# EAGLE design flasher (EAGLE 7.5.0)
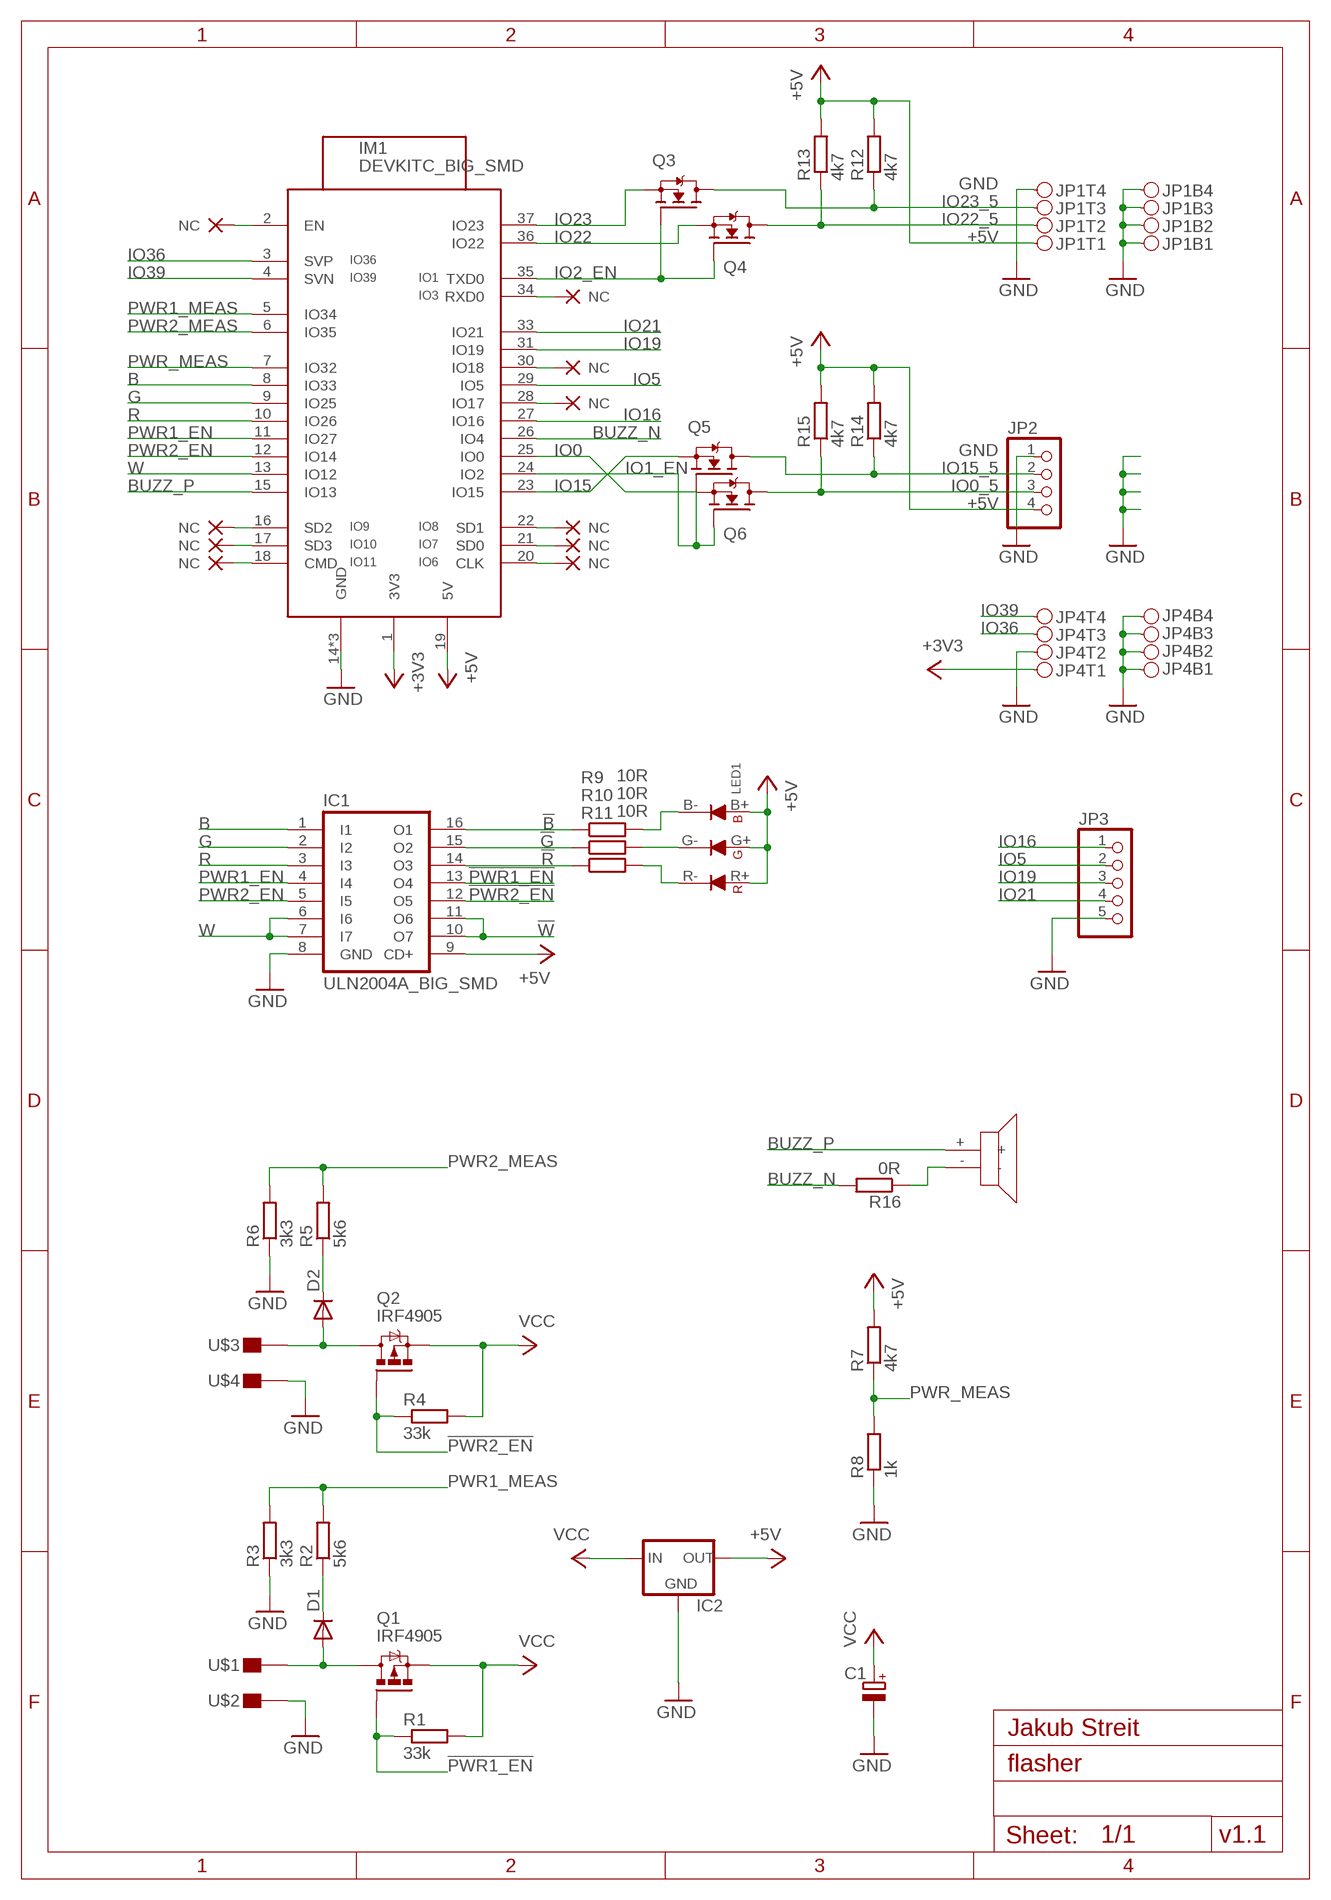
[diagram p0: schematic, sheet 1]

## Parts
C1  CPOL-EUE5-10.5  [E5-10,5]
D1  DIODE-SOD123  [SOD123]
D2  DIODE-SOD123  [SOD123]
IC1  ULN2004A_BIG_SMD  [DIL16_BIG_SMD]
IC2  78XXS  [78XXS]
IM1  DEVKITC_BIG_SMD  [DEVKITC_BIG_SMD]
JP1  PINH2X04  [PINH2X04SMD]
JP2  PINHD-1X4/90  [1X04/90]
JP3  PINHD-1X5  [1X05]
JP4  PINH2X04  [PINH2X04SMD]
LED1  RGB_LED  [HEX_HEATSINK]
NC1  NC  (no package)
NC2  NC  (no package)
NC3  NC  (no package)
NC4  NC  (no package)
NC5  NC  (no package)
NC6  NC  (no package)
NC7  NC  (no package)
NC8  NC  (no package)
NC9  NC  (no package)
NC10  NC  (no package)
Q1  IRF4905  IRF9530  [TO220BV]
Q2  IRF4905  IRF9530  [TO220BV]
Q3  N-MOSFET-SOT23-DIST  [SOT23_DIST]
Q4  N-MOSFET-SOT23-DIST  [SOT23_DIST]
Q5  N-MOSFET-SOT23-DIST  [SOT23_DIST]
Q6  N-MOSFET-SOT23-DIST  [SOT23_DIST]
R1  33k  R-EU_R0805S  [R0805S]
R2  5k6  R-EU_R0805S  [R0805S]
R3  3k3  R-EU_R0805S  [R0805S]
R4  33k  R-EU_R0805S  [R0805S]
R5  5k6  R-EU_R0805S  [R0805S]
R6  3k3  R-EU_R0805S  [R0805S]
R7  4k7  R-EU_R0805S  [R0805S]
R8  1k  R-EU_R0805S  [R0805S]
R9  10R  R-EU_R2512  [R2512]
R10  10R  R-EU_R2512  [R2512]
R11  10R  R-EU_R2512  [R2512]
R12  4k7  R-EU_R0805S  [R0805S]
R13  4k7  R-EU_R0805S  [R0805S]
R14  4k7  R-EU_R0805S  [R0805S]
R15  4k7  R-EU_R0805S  [R0805S]
R16  0R  R-EU_R0805S  [R0805S]
U$1  PAD_1SIDE_LARGE  [3X5MM]
U$2  PAD_1SIDE_LARGE  [3X5MM]
U$3  PAD_1SIDE_LARGE  [3X5MM]
U$4  PAD_1SIDE_LARGE  [3X5MM]
U$5  PIEZO  [PIEZO]

## Nets
!B: IC1.16(O1) R9.1
!G: IC1.15(O2) R10.1
!PWR1_EN: IC1.13(O4) Q1.G R1.1
!PWR2_EN: IC1.12(O5) Q2.G R4.1
!R: IC1.14(O3) R11.1
!W: IC1.10(O7) IC1.11(O6)
+3V3: IM1.1(3V3) JP4.T1
+5V: IC1.9(CD+) IC2.OUT IM1.19(5V) JP1.T1 JP2.4 LED1.B+(BA) LED1.G+(GA) LED1.R+(RA) R7.2 R12.2 R13.2 R14.2 R15.2
B: IC1.1(I1) IM1.8(IO33)
BA: LED1.B-(BC) R9.2
BUZZ-N: R16.1 U$5.-
BUZZ_N: IM1.26(IO4) R16.2
BUZZ_P: IM1.15(IO13) U$5.+
EN: IM1.2(EN) NC7.NC
G: IC1.2(I2) IM1.9(IO25)
GA: LED1.G-(GC) R10.2
GND: C1.- IC1.8(GND) IC2.GND IM1.14(GND) IM1.32(GND) IM1.38(GND) JP1.B1 JP1.B2 JP1.B3 JP1.B4 JP1.T4 JP2.1 JP3.5 JP4.B1 JP4.B2 JP4.B3 JP4.B4 JP4.T2 R3.1 R6.1 R8.1 U$2.1 U$4.1
IO0: IM1.25(IO0) Q6.2(S)
IO0_5: JP2.3 Q6.3(D) R15.1
IO1_EN: IM1.24(IO2) Q5.1(G) Q6.1(G)
IO2_EN: IM1.35(TXD0) Q3.1(G) Q4.1(G)
IO3: IM1.34(RXD0) NC10.NC
IO5: IM1.29(IO5) JP3.2
IO6: IM1.20(CLK) NC4.NC
IO7: IM1.21(SD0) NC5.NC
IO8: IM1.22(SD1) NC6.NC
IO9: IM1.16(SD2) NC1.NC
IO10: IM1.17(SD3) NC2.NC
IO11: IM1.18(CMD) NC3.NC
IO15: IM1.23(IO15) Q5.2(S)
IO15_5: JP2.2 Q5.3(D) R14.1
IO16: IM1.27(IO16) JP3.1
IO17: IM1.28(IO17) NC9.NC
IO18: IM1.30(IO18) NC8.NC
IO19: IM1.31(IO19) JP3.3
IO21: IM1.33(IO21) JP3.4
IO22: IM1.36(IO22) Q4.2(S)
IO22_5: JP1.T2 Q4.3(D) R13.1
IO23: IM1.37(IO23) Q3.2(S)
IO23_5: JP1.T3 Q3.3(D) R12.1
IO36: IM1.3(SVP) JP4.T3
IO39: IM1.4(SVN) JP4.T4
PWR1: D1.A Q1.D U$1.1
PWR1+: D1.C R2.1
PWR1_EN: IC1.4(I4) IM1.11(IO27)
PWR1_MEAS: IM1.5(IO34) R2.2 R3.2
PWR2: D2.A Q2.D U$3.1
PWR2+: D2.C R5.1
PWR2_EN: IC1.5(I5) IM1.12(IO14)
PWR2_MEAS: IM1.6(IO35) R5.2 R6.2
PWR_MEAS: IM1.7(IO32) R7.1 R8.2
R: IC1.3(I3) IM1.10(IO26)
RA: LED1.R-(RC) R11.2
VCC: C1.+ IC2.IN Q1.S Q2.S R1.2 R4.2
W: IC1.6(I6) IC1.7(I7) IM1.13(IO12)

## Notes on the sheet
- Jakub Streit
- v1.1

## Library data of the parts
C1 = rcl_upravena:CPOL-EU: POLARIZED CAPACITOR, European symbol
D1 D2 = diode:DIODE: DIODE ultra fast-recovery rectifier
IC1 = uln-udn_upravena:ULN2004A: DRIVER ARRAY
IC2 = v-reg:78XXS: VOLTAGE REGULATOR
IM1 = esp32:DEVKITC
JP1 JP4 = pinhead_smd:PINH2X04
JP2 = pinhead:PINHD-1X4: PIN HEADER
JP3 = pinhead:PINHD-1X5: PIN HEADER
LED1 = RGB_LED:RGB_LED
NC1-NC10 = NC:NC: _EXTERNAL_
Q1 Q2 = transistor-power:IRF9530: P-CHANNEL HEXFET POWER-MOS-FET Source: http://www.irf.com/product-info/datasheets/data/irf9530.pdf
Q3-Q6 = transistors:N-MOSFET
R1-R16 = rcl_upravena:R-EU_: RESISTOR, European symbol
U$1-U$4 = wirepad_smd:PAD
U$5 = piezo:PIEZO

## Board
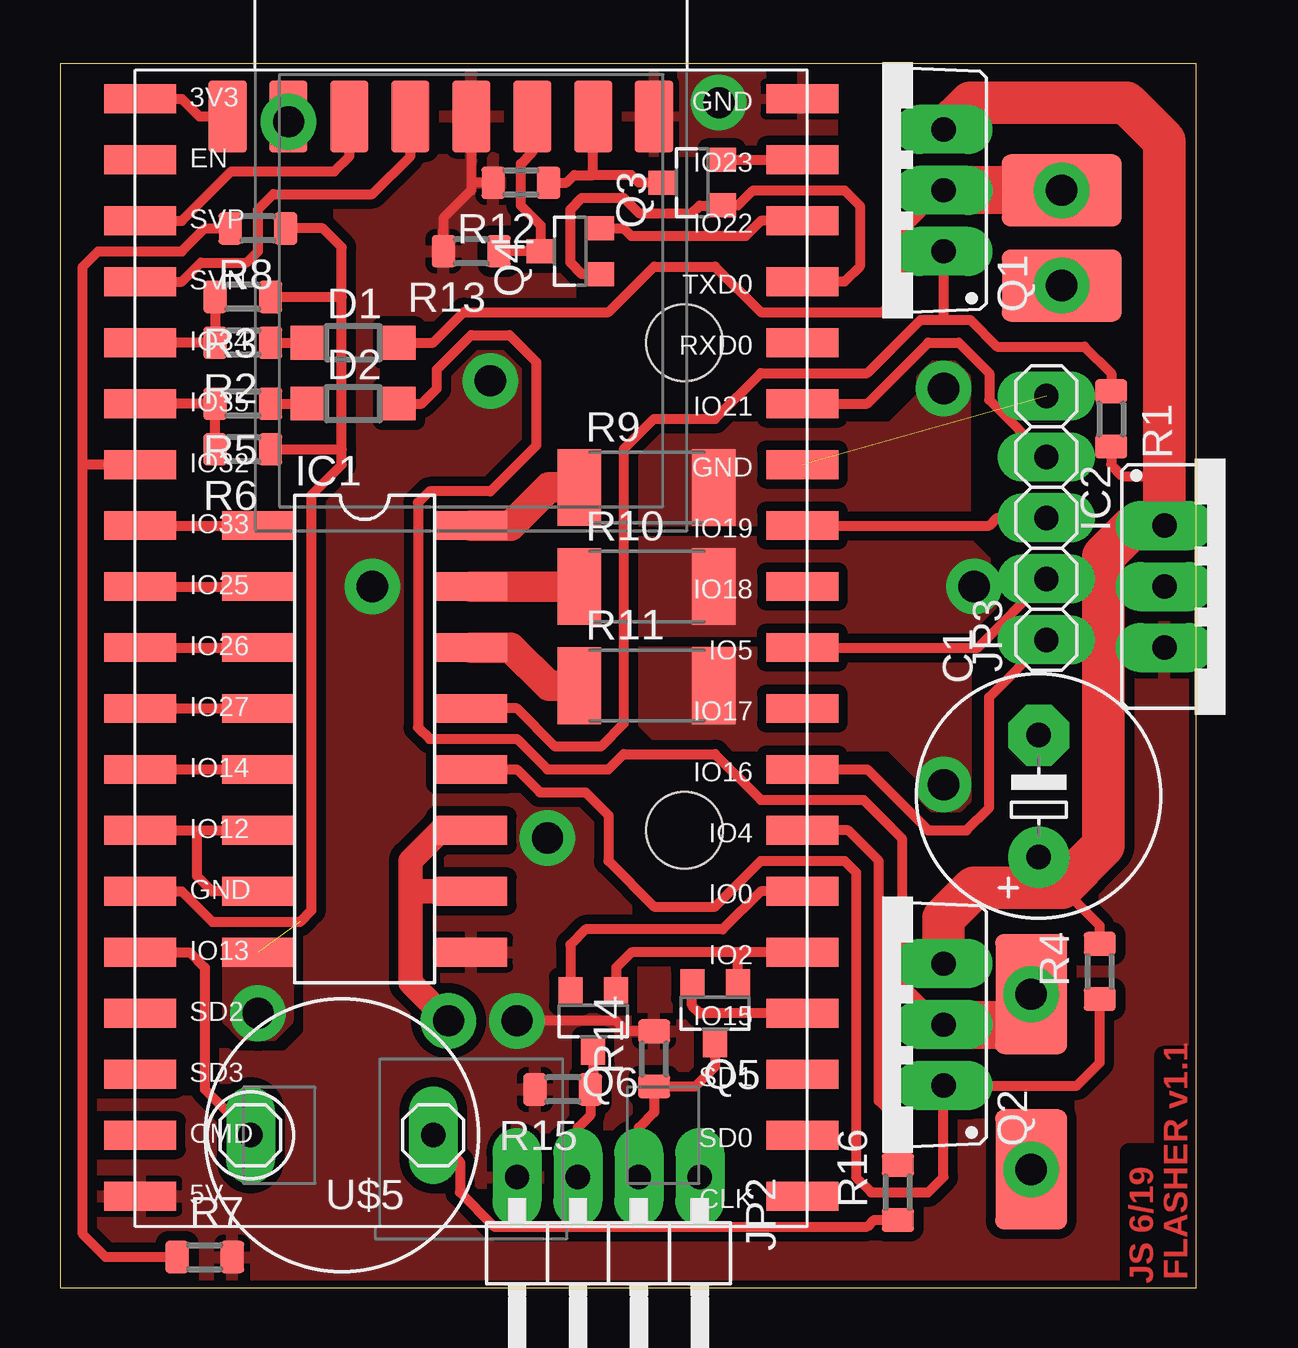
[diagram p1: board, top side]
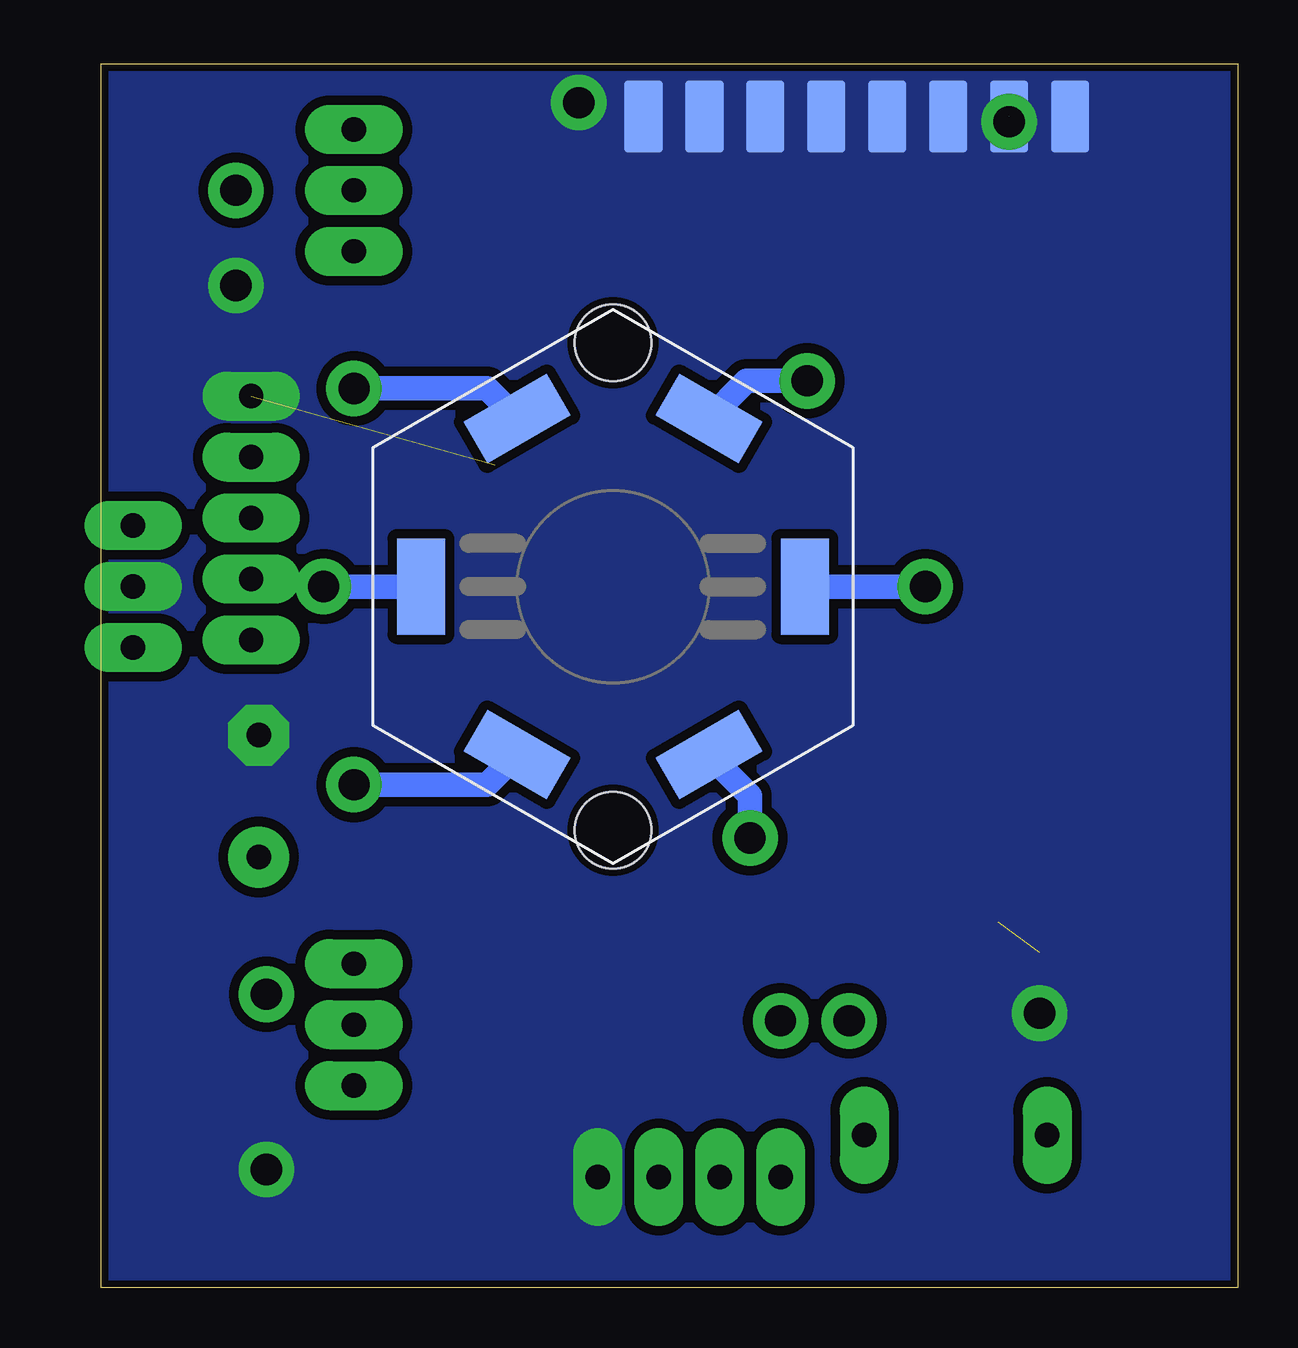
[diagram p2: board, bottom side, seen from below]

Size 47.37 x 51 mm. Coordinates in mm from the lower left corner, seen from the top.
Outline: 0,0 47.37,0 47.37,51 0,51 0,0
Copper layers (1*16): Top 0.035mm / dielectric 1.5mm / Bottom 0.035mm
Design rules "default *": minimum track width 0.4mm, minimum drill 0.8mm, track to track 0.4mm, track to pad 0.4mm, pad to pad 0.4mm, via to via 0.4mm, smd to smd 0mil, copper to edge 0.3mm, drill to drill 8mil, minimum pad ring 0.4mm, minimum via ring 0.3mm, stop-mask expansion 4mil, vias tented up to drill 0mil, thermal gap 10mil
Holes 3.2 mm at 26.04,39.37 26.04,19.05
tRestrict: area 23.1,16.2 to 28.9,21.9; area 23.1,36.5 to 28.9,42.3

### Footprints (pad centres in the part's own frame; a part is rotated, then mirrored left to right if it is on the bottom)
E5-10,5 = drill 1.016 pad 2.54: + -2.54,0 | drill 1.016 pad 2.54 octagon: - 2.54,0
SOD123 = smd 1.4 x 1.4: A 1.9,0; C -1.9,0
DIL16_BIG_SMD = smd 1.2 x 3: 1 -8.89,-4.445; 2 -6.35,-4.445; 3 -3.81,-4.445; 4 -1.27,-4.445; 5 1.27,-4.445; 6 3.81,-4.445; 7 6.35,-4.445; 8 8.89,-4.445; 9 8.89,4.445; 10 6.35,4.445; 11 3.81,4.445; 12 1.27,4.445; 13 -1.27,4.445; 14 -3.81,4.445; 15 -6.35,4.445; 16 -8.89,4.445
78XXS = drill 1.016 long: GND 0,-2.54; IN -2.54,-2.54; OUT 2.54,-2.54
DEVKITC_BIG_SMD = smd 3 x 1.2: 1 -13.8,46.99; 2 -13.8,44.45; 3 -13.8,41.91; 4 -13.8,39.37; 5 -13.8,36.83; 6 -13.8,34.29; 7 -13.8,31.75; 8 -13.8,29.21; 9 -13.8,26.67; 10 -13.8,24.13; 11 -13.8,21.59; 12 -13.8,19.05; 13 -13.8,16.51; 14 -13.8,13.97; 15 -13.8,11.43; 16 -13.8,8.89; 17 -13.8,6.35; 18 -13.8,3.81; 19 -13.8,1.27; 20 13.8,1.27; 21 13.8,3.81; 22 13.8,6.35; 23 13.8,8.89; 24 13.8,11.43; 25 13.8,13.97; 26 13.8,16.51; 27 13.8,19.05; 28 13.8,21.59; 29 13.8,24.13; 30 13.8,26.67; 31 13.8,29.21; 32 13.8,31.75; 33 13.8,34.29; 34 13.8,36.83; 35 13.8,39.37; 36 13.8,41.91; 37 13.8,44.45; 38 13.8,46.99
PINH2X04SMD = smd 1.6 x 3 bottom: B1 -3.81,-2; B2 -1.27,-2; B3 1.27,-2; B4 3.81,-2 | smd 1.6 x 3: T1 -3.81,-2; T2 -1.27,-2; T3 1.27,-2; T4 3.81,-2
1X04/90 = drill 1.016 long: 1 -3.81,-3.81; 2 -1.27,-3.81; 3 1.27,-3.81; 4 3.81,-3.81
1X05 = drill 1.016 long: 1 -5.08,0; 2 -2.54,0; 3 0,0; 4 2.54,0; 5 5.08,0
HEX_HEATSINK = smd 4 x 2 rotated 330: B+ 4,7; R- -4,-7 | smd 4 x 2 rotated 210: B- -4,7; R+ 4,-7 | smd 2 x 4: G+ 8,0; G- -8,0
TO220BV = drill 1.016 long: D 0,-2.54; G -2.54,-2.54; S 2.54,-2.54
SOT23_DIST = smd 1 x 1.2: 1 -0.95,-1.227; 2 0.95,-1.227; 3 0,1.227
R0805S = smd 1 x 1.35: 1 -1.15,0; 2 1.15,0
R2512 = smd 1.8 x 3.2: 1 -2.8,0; 2 2.8,0
3X5MM = smd 3 x 5: 1 0,0
PIEZO = drill 1.016 long: + 1.27,8.89; - 1.27,1.27

### Placement (x,y rotation side)
C1  40.8,20.48 90 top
D1  12.22,39.37 0 top
D2  12.22,36.83 0 top
IC1  12.7,22.86 270 top
IC2  48.58,29.21 270 top
IM1  17.14,2.54 0 top
JP1  20.95,50.8 0 top
JP2  22.86,0.79 180 top
JP3  41.12,32.07 90 top
JP4  10.79,50.8 0 top
LED1  26.04,29.21 0 bottom
Q1  34.29,45.72 90 top
Q2  34.29,10.95 90 top
Q3  26.35,46.04 90 top
Q4  21.27,43.18 90 top
Q5  27.3,11.43 180 top
Q6  22.23,11.11 180 top
R1  100k  [R0805S]  43.81,36.2 270 top
R2  18k  [R0805S]  7.62,39.37 180 top
R3  33k  [R0805S]  7.62,41.27 180 top
R4  100k  [R0805S]  43.34,13.18 90 top
R5  18k  [R0805S]  7.62,36.83 180 top
R6  33k  [R0805S]  7.62,34.92 180 top
R7  6.03,1.27 0 top
R8  8.26,44.13 180 top
R9  24.45,33.34 0 top
R10  24.45,29.21 0 top
R11  24.45,25.08 0 top
R12  18k  [R0805S]  19.21,46.04 180 top
R13  18k  [R0805S]  17.14,43.18 180 top
R14  18k  [R0805S]  24.77,9.53 90 top
R15  18k  [R0805S]  20.95,8.26 180 top
R16  18k  [R0805S]  34.92,3.97 90 top
U$1  41.75,45.72 270 top
U$2  41.75,41.75 270 top
U$3  40.48,12.22 180 top
U$4  40.48,4.92 0 top
U$5  16.83,5.08 90 top

### Tracks (layer width: path | path; a pad name or v marks a point on that pad's centre or on a via)
!B
  Top 1.27: IC1.16 18.79,31.75 20.38,33.34 R9.1
!G
  Top 1.27: IC1.15 R10.1
!PWR1_EN
  Top 0.406: IC1.13 19.05,24.13 20.64,22.54 22.54,22.54 23.5,23.5 23.5,34.92 24.77,36.2 27.3,36.2 29.21,38.1 33.66,38.1 35.88,40.32 36.83,40.32 | 36.83,40.32 37.94,40.32 39.05,39.21 42.7,39.21 43.81,38.1 R1.1 | Q1.G 36.83,40.32
!PWR2_EN
  Top 0.406: IC1.12 19.05,21.59 20,20.64 21.91,20.64 22.86,19.68 22.86,17.78 24.77,15.88 27.3,15.88 29.21,17.78 32.7,17.78 33.18,17.3 33.18,4.6 33.81,3.97 36.2,3.97 36.83,4.6 Q2.G 42.39,8.41 43.34,9.37 R4.1
!R
  Top 1.27: IC1.14 18.79,26.67 20.38,25.08 R11.1
!W  (via drill 1.3)
  Top 1.016: IC1.11 15.88,19.05 14.61,17.78 14.61,16.51 | 14.61,16.51 14.61,12.7 v16.19,11.11 | IC1.10 14.61,16.51
+3V3
  Top 0.406: IM1.1 5.08,49.53 5.81,48.8 JP4.T1
+5V  (via drill 1.3)
  Top 0.406: JP1.T1 17.14,46.04 | 17.14,46.04 17.14,45.72 15.99,44.57 R13.2 | R12.2 17.14,46.04 | R14.2 23.61,10.68 23.18,11.11 v19.05,11.11
  Bottom 1.016: LED1.R+ 20.32,20.5 v20.32,18.73 | LED1.G+ v13.02,29.21 | LED1.B+ 20.46,37.78 v17.94,37.78
  pour Top (rank 3): 0,50.8 0,0 47.47,0 47.47,50.8
B
  Top 0.406: IM1.8 IC1.1
BA  (via drill 1.3)
  Bottom 1.016: LED1.B- 31.29,37.47 v36.83,37.47
  pour Top (rank 2, no thermals): 23.97,31.75 37.78,31.75 37.78,38.1 37.47,38.42 36.2,38.42 35.88,38.1 35.88,37.15 34.61,35.88 25.24,35.88 23.97,34.61
BUZZ-N
  Top 0.406: U$5.- 16.67,5.24 16.67,3.97 18.1,2.54 33.66,2.54 33.93,2.82 R16.1
BUZZ_N
  Top 0.406: IM1.26 32.86,19.05 34.13,17.78 34.13,7.78 34.92,6.99 R16.2
BUZZ_P
  Top 0.406: IM1.15 5.4,13.97 6.03,13.34 6.03,8.26 U$5.+
G
  Top 0.406: IM1.9 IC1.2
GA  (via drill 1.3)
  Bottom 1.016: LED1.G- v38.1,29.21
  pour Top (no thermals): 23.97,31.11 37.78,31.11 39.05,29.84 39.05,28.57 37.78,27.3 23.97,27.3
GND  (via drill 1.3)  (3 unrouted)
  Top 0.406: IM1.14 5.08,16.51 6.35,15.24 10,15.24 10.48,15.72 10.48,33.02 11.75,34.29 11.75,34.92 | R6.1 11.75,34.92 | 11.75,34.92 11.75,41.27 | 11.75,41.27 11.75,43.34 10.95,44.13 R8.1 | R3.1 11.75,41.27
  other vias: 8.26,11.43 27.46,49.37 9.53,48.58 41.75,41.75 40.48,4.92
  pour Top (no thermals): 6.99,14.29 9.53,14.29 9.53,11.11 8.89,10.48 7.62,10.48 6.99,11.11
  pour Bottom (rank 3, no thermals): 0,0 47.62,0 47.62,50.8 0,50.8
  pour Top: 23.5,50.8 32.23,50.8 32.23,45.72 28.57,45.72 26.99,47.31 23.5,47.31
IO0
  Top 0.406: IM1.25 29.21,16.51 27.62,14.92 21.91,14.92 21.27,14.29 Q6.2
IO0_5
  Top 0.406: Q6.3 22.23,8.26 R15.1 22.11,7.18 21.59,6.67 JP2.3
IO1_EN
  Top 0.406: IM1.24 28.26,13.97 | 28.26,13.97 23.81,13.97 23.18,13.34 Q6.1 | Q5.1 28.25,13.97 28.26,13.97
IO2_EN
  Top 0.406: Q4.1 21.75,42.23 21.27,42.7 21.27,44.93 21.75,45.4 23.5,45.4 24.13,44.77 26.35,44.77 26.67,45.09 Q3.1 28.26,45.09 28.89,45.72 32.7,45.72 33.34,45.09 33.34,42.55 32.7,41.91 IM1.35
IO5
  Top 0.406: IM1.29 38.26,26.67 JP3.2
IO15
  Top 0.406: IM1.23 26.67,11.43 26.35,11.75 Q5.2
IO15_5
  Top 0.406: Q5.3 27.3,9.21 26.47,8.38 R14.1 24.77,7.3 24.13,6.67 JP2.2
IO16
  Top 0.406: IM1.27 33.66,21.59 36.2,19.05 37.78,19.05 38.73,20 38.73,24.61 JP3.1
IO19
  Top 0.406: IM1.31 38.73,31.75 39.05,32.07 JP3.3
IO21
  Top 0.406: IM1.33 33.66,36.83 36.2,39.37 37.47,39.37 38.73,38.1 38.73,36.99 JP3.4
IO22
  Top 0.406: IM1.36 29.21,44.45 28.57,43.81 23.81,43.81 23.5,44.13 Q4.2
IO22_5
  Top 0.406: JP1.T2 19.68,47.31 19.21,46.83 19.21,45.09 20.05,44.25 Q4.3 R13.1
IO23
  Top 0.406: Q3.2 IM1.37
IO23_5
  Top 0.406: Q3.3 24.13,46.04 23.81,46.35 22.23,46.35 | 22.23,46.35 JP1.T3 | R12.1 21.11,46.04 21.43,46.35 22.23,46.35
IO36
  Top 0.406: IM1.3 5.08,44.45 7.14,46.51 11.43,46.51 12.06,47.15 JP4.T3
IO39
  Top 0.406: IM1.4 5.08,41.91 5.87,42.7 7.78,42.7 8.26,43.18 8.26,44.93 8.89,45.56 13.02,45.56 14.61,47.15 JP4.T4
PWR1  (via drill 1.3)
  Top 0.406: D1.A 15.56,39.37 16.83,40.64 22.86,40.64 24.77,42.55 27.3,42.55 29.21,40.64 34.29,40.64 35.08,41.43 35.08,43.97 Q1.D
  Top 2: U$1.1 Q1.D
  other vias: 41.75,45.72
PWR1+
  Top 0.406: R2.1 D1.C
PWR1_EN
  Top 0.406: IM1.11 IC1.4
PWR1_MEAS
  Top 0.406: IM1.5 R2.2 R3.2
PWR2  (via drill 1.3)
  Top 0.406: D2.A 15.08,36.83 15.72,37.47 15.72,38.26 17.14,39.69 18.73,39.69 19.84,38.58 19.84,35.08 17.94,33.18 15.4,33.18 14.92,32.7 14.92,23.34 15.4,22.86 19.05,22.86 20.32,21.59 22.86,21.59 23.5,22.23 27.3,22.23 29.21,20.32 33.5,20.32 35.08,18.73 35.08,12.7 Q2.D
  Top 2: Q2.D 40.48,10.95 U$3.1
  other vias: 40.48,12.22
PWR2+
  Top 0.406: R5.1 D2.C
PWR2_EN
  Top 0.406: IM1.12 IC1.5
PWR2_MEAS
  Top 0.406: IM1.6 R5.2 R6.2
PWR_MEAS
  Top 0.406: R7.1 1.91,1.27 0.95,2.22 0.95,34.29 | 0.95,34.29 0.95,42.55 1.59,43.18 5.08,43.18 6.03,44.13 R8.2 | IM1.7 0.95,34.29
R
  Top 0.406: IM1.10 IC1.3
RA  (via drill 1.3)
  Bottom 1.016: LED1.R- 31.29,20.95 v36.83,20.95
  pour Top (rank 2, no thermals): 23.97,26.67 37.78,26.67 37.78,20.32 37.47,20 36.2,20 35.88,20.32 35.88,21.27 34.61,22.54 25.24,22.54 23.97,23.81
VCC
  Top 0.406: R4.2 43.34,15.08 41.75,16.67 | R1.2 43.81,34.29 44.29,33.81 46.04,33.81
  Top 1.778: Q1.S 37.94,49.37 44.45,49.37 46.04,47.78 46.04,33.81 IC2.IN 44.77,31.75 43.5,30.48 43.5,18.41 41.75,16.67 40.8,16.67 | 40.8,16.67 38.1,16.67 36.83,15.4 Q2.S | C1.+ 40.8,16.67
W
  Top 0.406: IM1.13 5.71,19.05 | 5.71,19.05 IC1.6 | IC1.7 6.35,16.51 5.71,17.14 5.71,19.05

### Text on the board
Top: JS 6/19 | FLASHER v1.1